# EAGLE design trig3_board_de0-nano_2x13 (EAGLE 9.2.0)
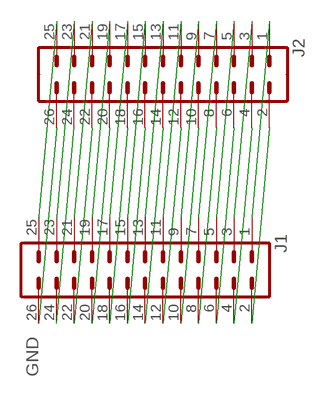
[diagram p0: schematic, sheet 1]

## Parts
J1  M13X22X13  [2X13]
J2  M13X22X13  [2X13]

## Nets
GND: J1.26 J2.26
N$1: J1.1 J2.1
N$2: J1.3 J2.3
N$3: J1.5 J2.5
N$4: J1.7 J2.7
N$5: J1.9 J2.9
N$6: J1.11 J2.11
N$7: J1.13 J2.13
N$8: J1.15 J2.15
N$9: J1.17 J2.17
N$10: J1.19 J2.19
N$11: J1.21 J2.21
N$12: J1.23 J2.23
N$13: J1.25 J2.25
N$14: J1.2 J2.2
N$15: J1.4 J2.4
N$16: J1.6 J2.6
N$17: J1.8 J2.8
N$18: J1.10 J2.10
N$19: J1.12 J2.12
N$20: J1.14 J2.14
N$21: J1.16 J2.16
N$22: J1.18 J2.18
N$23: J1.20 J2.20
N$24: J1.22 J2.22
N$25: J1.24 J2.24

## Library data of the parts
J1 J2 = SparkFun-Connectors:M13X2: 0.1" spaced headers

## Net classes
0 default: width 0.254 mm
1 power: width 0.762 mm

## Board
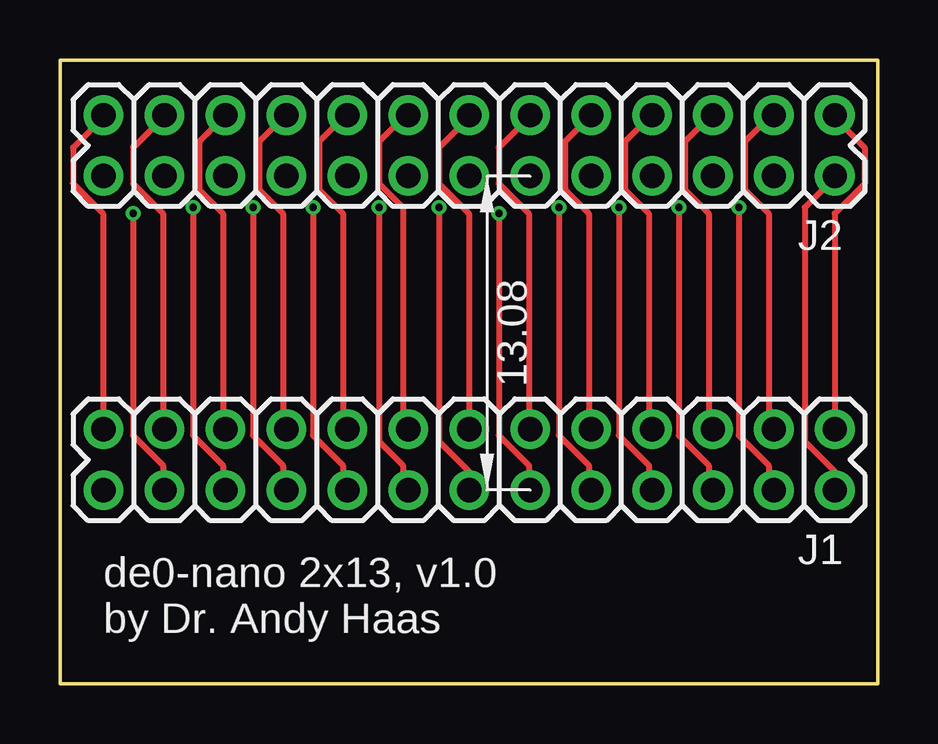
[diagram p1: board, top side]
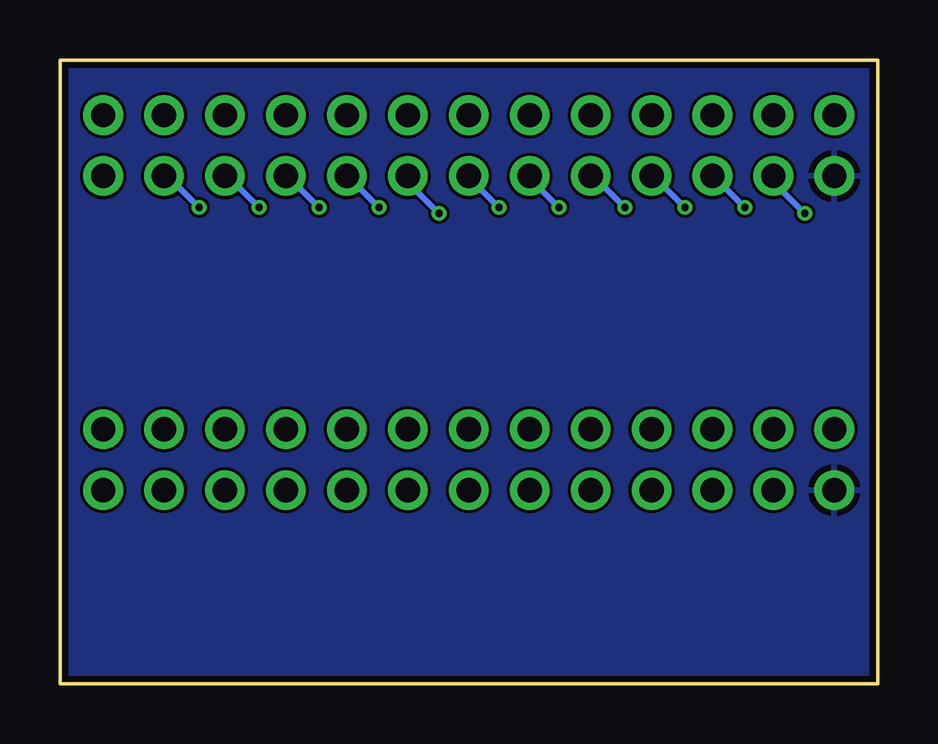
[diagram p2: board, bottom side, seen from below]

Size 34.1 x 26 mm. Coordinates in mm from the lower left corner, seen from the top.
Outline: 0,26 34.1,26 34.1,0 0,0 0,26
Copper layers (1*16): Top 0.035mm / dielectric 1.5mm / Bottom 0.035mm
Design rules "MF_Standard_2_Layer": minimum track width 5mil, minimum drill 12mil, track to track 5mil, track to pad 5mil, pad to pad 5mil, via to via 5mil, smd to smd 0mil, copper to edge 10mil, drill to drill 10mil, minimum pad ring 6mil, minimum via ring 6mil, stop-mask expansion 2mil, vias tented up to drill 25mil, thermal gap 10mil

### Footprints (pad centres in the part's own frame; a part is rotated, then mirrored left to right if it is on the bottom)
2X13 = drill 1.016 pad 1.651: 1 0,0; 2 0,2.54; 3 2.54,0; 4 2.54,2.54; 5 5.08,0; 6 5.08,2.54; 7 7.62,0; 8 7.62,2.54; 9 10.16,0; 10 10.16,2.54; 11 12.7,0; 12 12.7,2.54; 13 15.24,0; 14 15.24,2.54; 15 17.78,0; 16 17.78,2.54; 17 20.32,0; 18 20.32,2.54; 19 22.86,0; 20 22.86,2.54; 21 25.4,0; 22 25.4,2.54; 23 27.94,0; 24 27.94,2.54; 25 30.48,0; 26 30.48,2.54

### Placement (x,y rotation side)
J1  32.3,10.6 180 top
J2  32.3,23.7 180 top

### Tracks (layer width: path | path; a pad name or v marks a point on that pad's centre or on a via)
GND
  pour Bottom: -1.2,27.1 34.8,27.1 34.8,-1.9 -1.2,-1.9
N$1
  Top 0.254: J1.1 32.3,19.6 33.55,20.85 33.55,22.35 32.3,23.6 J2.1
N$2
  Top 0.254: J1.3 29.55,10.6 29.55,19.6 28.55,20.6 28.55,22.6 29.55,23.6 J2.3
N$3
  Top 0.254: J1.5 27.05,10.6 27.05,19.6 26.05,20.6 26.05,22.6 27.05,23.6 J2.5
N$4
  Top 0.254: J1.7 24.55,10.6 24.55,19.6 23.55,20.6 23.55,22.6 24.55,23.6 J2.7
N$5
  Top 0.254: J1.9 22.05,10.6 22.05,19.6 21.05,20.6 21.05,22.6 22.05,23.6 J2.9
N$6
  Top 0.254: J1.11 19.55,10.6 19.55,19.6 18.3,20.85 18.3,22.35 19.55,23.6 J2.11
N$7
  Top 0.254: J1.13 17.05,19.6 15.8,20.85 15.8,22.35 17.05,23.6 J2.13
N$8
  Top 0.254: J1.15 14.3,10.6 14.3,19.85 13.3,20.85 13.3,22.6 14.3,23.6 J2.15
N$9
  Top 0.254: J1.17 11.8,10.6 11.8,19.6 10.8,20.6 10.8,22.6 11.8,23.6 J2.17
N$10
  Top 0.254: J1.19 9.3,10.6 9.3,19.6 8.3,20.6 8.3,22.6 9.3,23.6 J2.19
N$11
  Top 0.254: J2.21 5.8,22.6 5.8,20.6 6.8,19.6 6.8,10.6 J1.21
N$12
  Top 0.254: J1.23 4.3,10.6 4.3,19.6 3.05,20.85 3.05,22.35 4.3,23.6 J2.23
N$13
  Top 0.254: J1.25 1.8,10.6 1.8,19.6 0.55,20.85 0.55,22.35 1.8,23.6 J2.25
N$14
  Top 0.254: J1.2 32.3,8.85 31.05,10.1 31.05,19.85 32.3,21.1 J2.2
N$15  (via drill 0.3)
  Top 0.254: v28.3,19.85 28.3,10.35 29.55,9.1 29.55,8.1 J1.4
  Bottom 0.254: v28.3,19.85 29.55,21.1 J2.4
N$16  (via drill 0.3)
  Top 0.254: v25.8,19.85 25.8,10.35 27.05,9.1 27.05,8.1 J1.6
  Bottom 0.254: v25.8,19.85 27.05,21.1 J2.6
N$17  (via drill 0.3)
  Top 0.254: v23.3,19.85 23.3,10.35 24.55,9.1 24.55,8.1 J1.8
  Bottom 0.254: v23.3,19.85 24.55,21.1 J2.8
N$18  (via drill 0.3)
  Top 0.254: v20.8,19.85 20.8,10.35 22.05,9.1 22.05,8.1 J1.10
  Bottom 0.254: v20.8,19.85 22.05,21.1 J2.10
N$19  (via drill 0.3)
  Top 0.254: v18.3,19.6 18.3,10.35 19.55,9.1 19.55,8.1 J1.12
  Bottom 0.254: v18.3,19.6 19.8,21.1 J2.12
N$20  (via drill 0.3)
  Top 0.254: v15.8,19.85 15.8,10.1 17.05,8.85 17.05,8.1 J1.14
  Bottom 0.254: v15.8,19.85 17.05,21.1 J2.14
N$21  (via drill 0.3)
  Top 0.254: v13.3,19.85 13.3,10.1 14.3,9.1 14.3,8.1 J1.16
  Bottom 0.254: v13.3,19.85 14.55,21.1 J2.16
N$22  (via drill 0.3)
  Top 0.254: v10.55,19.85 10.55,10.35 11.8,9.1 11.8,8.1 J1.18
  Bottom 0.254: v10.55,19.85 11.8,21.1 J2.18
N$23  (via drill 0.3)
  Top 0.254: v8.05,19.85 8.05,10.35 9.3,9.1 9.3,8.1 J1.20
  Bottom 0.254: v8.05,19.85 9.3,21.1 J2.20
N$24  (via drill 0.3)
  Top 0.254: v5.55,19.85 5.55,10.35 6.8,9.1 6.8,8.1 J1.22
  Bottom 0.254: v5.55,19.85 6.8,21.1 J2.22
N$25  (via drill 0.3)
  Top 0.254: v3.05,19.6 3.05,10.35 4.3,9.1 4.3,8.1 J1.24
  Bottom 0.254: v3.05,19.6 4.55,21.1 J2.24

### Text on the board
tPlace: de0-nano 2x13, v1.0 / by Dr. Andy Haas